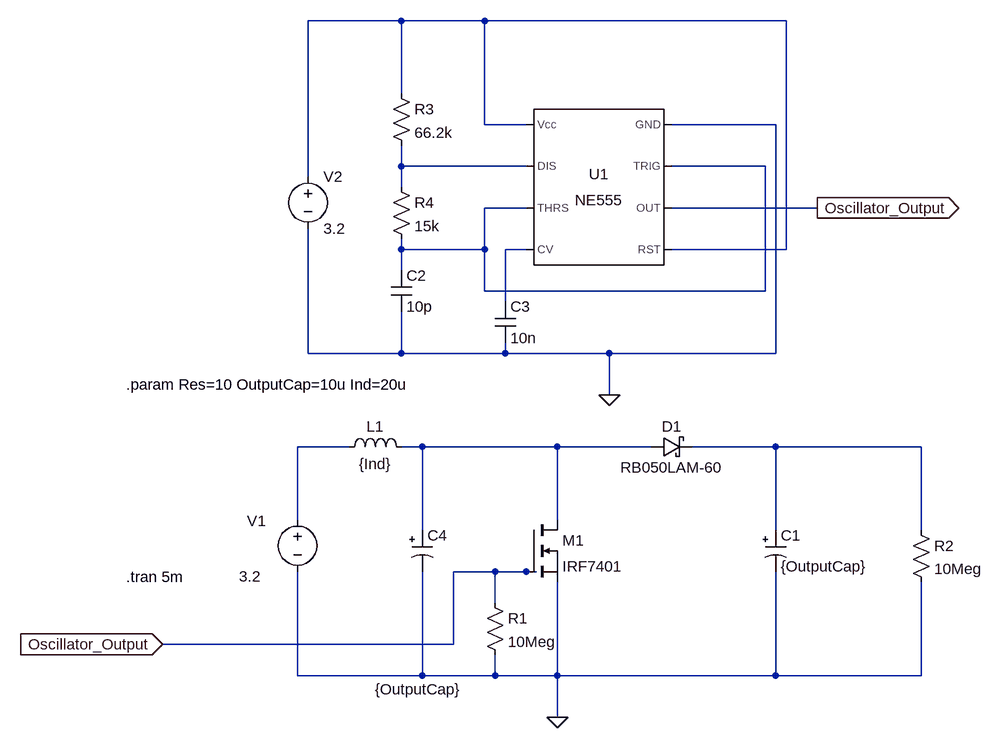
[diagram p0: schematic DC to DC Step up Converter.asc]
DC to DC Step up Converter.asc, the LTspice schematic file:
Version 4
SHEET 1 1016 680
WIRE 112 -576 -32 -576
WIRE 240 -576 112 -576
WIRE 704 -576 240 -576
WIRE 112 -464 112 -576
WIRE 240 -416 240 -576
WIRE 304 -416 240 -416
WIRE 688 -416 528 -416
WIRE 112 -352 112 -384
WIRE 304 -352 112 -352
WIRE 672 -352 528 -352
WIRE -32 -336 -32 -576
WIRE 112 -320 112 -352
WIRE 304 -288 240 -288
WIRE 752 -288 528 -288
WIRE 112 -224 112 -240
WIRE 240 -224 240 -288
WIRE 240 -224 112 -224
WIRE 304 -224 272 -224
WIRE 704 -224 704 -576
WIRE 704 -224 528 -224
WIRE 112 -192 112 -224
WIRE 240 -160 240 -224
WIRE 672 -160 672 -352
WIRE 672 -160 240 -160
WIRE 272 -144 272 -224
WIRE -32 -64 -32 -256
WIRE 112 -64 112 -128
WIRE 112 -64 -32 -64
WIRE 272 -64 272 -80
WIRE 272 -64 112 -64
WIRE 432 -64 272 -64
WIRE 688 -64 688 -416
WIRE 688 -64 432 -64
WIRE 432 0 432 -64
WIRE 32 80 -48 80
WIRE 144 80 112 80
WIRE 352 80 144 80
WIRE 496 80 352 80
WIRE 688 80 560 80
WIRE 912 80 688 80
WIRE -48 192 -48 80
WIRE 352 192 352 80
WIRE 144 208 144 80
WIRE 688 208 688 80
WIRE 912 208 912 80
WIRE 256 272 192 272
WIRE 304 272 256 272
WIRE 320 272 304 272
WIRE 256 320 256 272
WIRE 192 384 192 272
WIRE 192 384 -256 384
WIRE -48 432 -48 272
WIRE 144 432 144 272
WIRE 144 432 -48 432
WIRE 256 432 256 400
WIRE 256 432 144 432
WIRE 352 432 352 288
WIRE 352 432 256 432
WIRE 688 432 688 272
WIRE 688 432 352 432
WIRE 912 432 912 288
WIRE 912 432 688 432
WIRE 352 496 352 432
FLAG -256 384 Oscillator_Output
IOPIN -256 384 In
FLAG 432 0 0
FLAG 752 -288 Oscillator_Output
IOPIN 752 -288 Out
FLAG 352 496 0
SYMBOL voltage -48 176 R0
WINDOW 0 -78 18 Left 2
WINDOW 3 -90 103 Left 2
WINDOW 123 0 0 Left 0
WINDOW 39 0 0 Left 0
SYMATTR InstName V1
SYMATTR Value 3.2
SYMBOL ind 16 96 R270
WINDOW 0 32 56 VTop 2
WINDOW 3 5 56 VBottom 2
SYMATTR InstName L1
SYMATTR Value {Ind}
SYMBOL nmos 304 192 R0
SYMATTR InstName M1
SYMATTR Value IRF7401
SYMBOL schottky 496 96 R270
WINDOW 0 32 32 VTop 2
WINDOW 3 0 32 VBottom 2
SYMATTR InstName D1
SYMATTR Value RB050LAM-60
SYMATTR Description Diode
SYMATTR Type diode
SYMBOL polcap 672 208 R0
SYMATTR InstName C1
SYMATTR Value {OutputCap}
SYMBOL res 896 192 R0
SYMATTR InstName R2
SYMATTR Value 10Meg
SYMBOL res 96 -480 R0
SYMATTR InstName R3
SYMATTR Value 66.2k
SYMATTR SpiceLine tol=5
SYMBOL res 96 -336 R0
SYMATTR InstName R4
SYMATTR Value 15k
SYMATTR SpiceLine tol=5 pwr=0.1
SYMBOL cap 96 -192 R0
SYMATTR InstName C2
SYMATTR Value 10p
SYMBOL voltage -32 -352 R0
WINDOW 123 0 0 Left 0
WINDOW 39 0 0 Left 0
SYMATTR InstName V2
SYMATTR Value 3.2
SYMBOL Misc\\NE555 416 -320 M0
SYMATTR InstName U1
SYMBOL cap 256 -144 R0
SYMATTR InstName C3
SYMATTR Value 10n
SYMBOL polcap 128 208 R0
WINDOW 3 -57 245 Left 2
SYMATTR Value {OutputCap}
SYMATTR InstName C4
SYMBOL res 240 304 R0
SYMATTR InstName R1
SYMATTR Value 10Meg
TEXT -312 -16 Left 2 !.param Res=10 OutputCap=10u Ind=20u
TEXT -312 280 Left 2 !.tran 5m

The netlist it stands for:
* DC to DC Step up Converter.asc
V1 N005 0 3.2
L1 N005 N006 {Ind}
M1 N006 Oscillator_Output 0 0 IRF7401
D1 N006 N007 RB050LAM-60
C1 N007 0 {OutputCap}
R2 N007 0 10Meg
R3 N001 N002 66.2k tol=5
R4 N002 N003 15k tol=5 pwr=0.1
C2 N003 0 10p
V2 N001 0 3.2
XU1 0 N003 Oscillator_Output N001 N004 N003 N002 N001 NE555  ; pins GND TRIG OUT RST CV THRS DIS Vcc
C3 N004 0 10n
C4 N006 0 {OutputCap}
R1 Oscillator_Output 0 10Meg
.model D D
.lib standard.dio
.model NMOS NMOS
.model PMOS PMOS
.lib standard.mos
.param Res=10 OutputCap=10u Ind=20u
.tran 5m
.lib NE555.sub
.backanno
.end